# Altium schematic sheet UART_2_MUX.SchDoc
size 250 x 160 mm; SheetNumber: 15; SheetTotal: 15
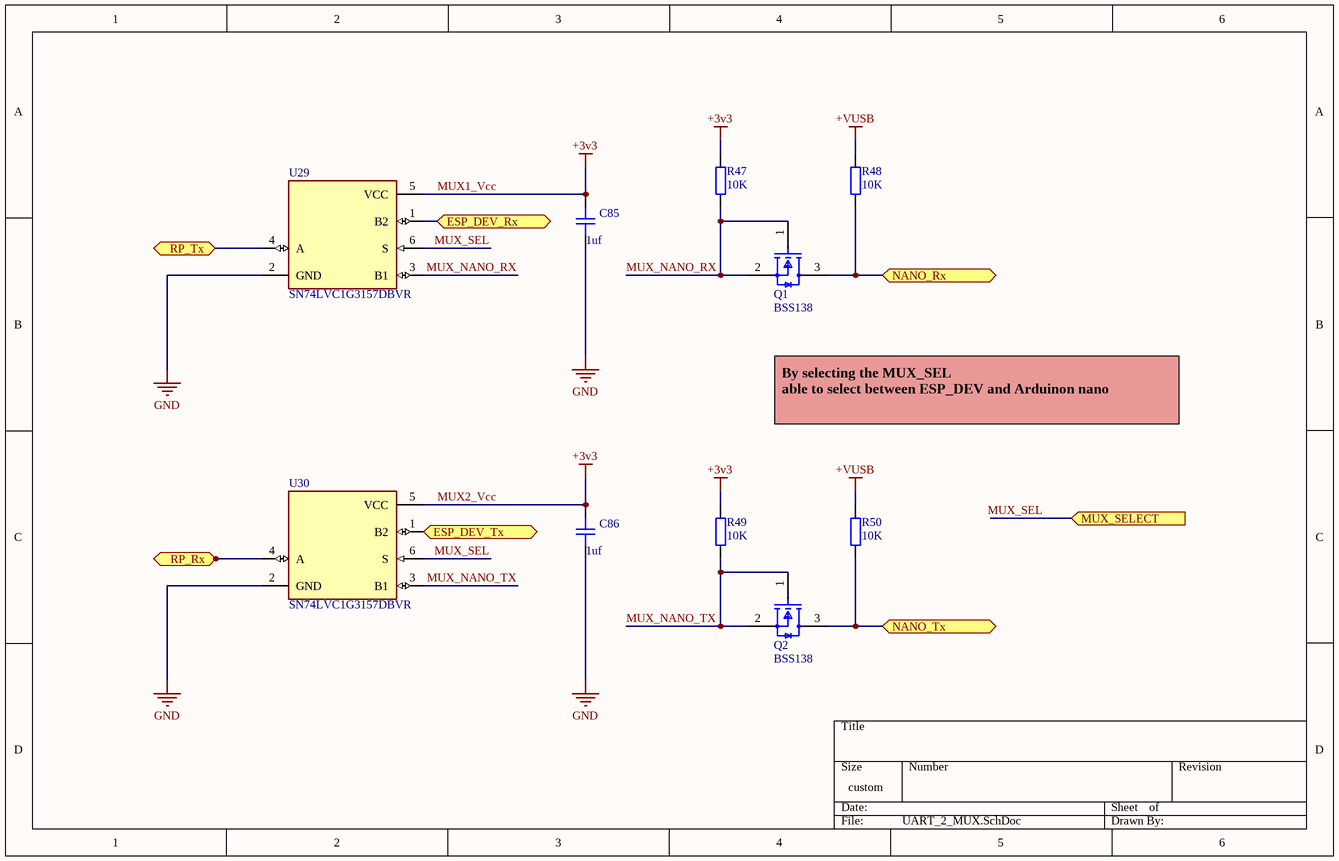
[diagram p0: UART_2_MUX.SchDoc]

## Parts
C85  1uf  [CAP_0603]
C86  1uf  [CAP_0603]
Q1  BSS138  [FP-318-08-IPC_B]
Q2  BSS138  [FP-318-08-IPC_B]
R47  10K  [RES_0603]
R48  10K  [RES_0603]
R49  10K  [RES_0603]
R50  10K  [RES_0603]
U29  SN74LVC1G3157DBVR  [FP-DBV0006A-IPC_C]
U30  SN74LVC1G3157DBVR  [FP-DBV0006A-IPC_C]

## Ports
ESP_DEV_Rx (bidir), ESP_DEV_Tx (bidir), MUX_SELECT (in), NANO_Rx (bidir), NANO_Tx (bidir), RP_Rx (bidir), RP_Tx (bidir)

## Nets
+VUSB: R48.1 R50.1
GND: C85.1 C86.1 U29.2(GND) U30.2(GND)
MUX1_Vcc: C85.2 C86.2 R47.1 R49.1 U29.5(VCC) U30.5(VCC)  [also labelled +3v3, MUX2_Vcc]
ESP_DEV_Rx: U29.1(B2) ; port ESP_DEV_Rx
ESP_DEV_Tx: U30.1(B2) ; port ESP_DEV_Tx
MUX_NANO_RX: Q1.1(G) Q1.2(S) R47.2 U29.3(B1)
MUX_NANO_TX: Q2.1(G) Q2.2(S) R49.2 U30.3(B1)
MUX_SEL: U29.6(S) U30.6(S) ; port MUX_SELECT
NANO_Rx: Q1.3(D) R48.2 ; port NANO_Rx
NANO_Tx: Q2.3(D) R50.2 ; port NANO_Tx
RP_Rx: U30.4(A) ; port RP_Rx
RP_Tx: U29.4(A) ; port RP_Tx

## Notes on the sheet
- By selecting the MUX_SEL
  able to select between ESP_DEV and Arduinon nano

## Library data of the parts
C85 C86 = CAP_0603: Capacitor SMD 0603; Manufacturer: *; Manufacturer Part Number: *; Distributor Link: *; LCSC: *; Rating: *; Dielectric: *
Q1 Q2 = CMP-07173-000101-1: MOSFET N-CH 50V 220MA SOT-23; Turn-Off Delay Time: 20ns; Element Configuration: Single; Rds On Max: 3.5R; Gate to Source Voltage (Vgs): 20V; Threshold Voltage: 1.3V; Number of Elements: 1; Power Dissipation: 360mW; Rise Time: 9ns; Turn-On Delay Time: 2.5ns; Input Capacitance: 27pF; On-State Resistance: 6R; Lead Free: Lead Free; Length: 2.92mm; Width: 1.3mm; Drain to Source Breakdown Voltage: 50V; Min Operating Temperature: -55°C; REACH SVHC: No SVHC; Packaging: Tape and Reel; Radiation Hardening: No; Height: 0.93mm; Drain to Source Voltage (Vdss): 50V; Current Rating: 220mA; Voltage Rating (DC): 50V; Weight: 0.03g; Continuous Drain Current (ID): 220mA; Number of Pins: 3; Nominal Vgs: 1.3V; Max Power Dissipation: 360mW; Fall Time: 9ns; Drain to Source Resistance: 3.5R; Contact Plating: Tin; Case/Package: SOT-23; Package Quantity: 1; Dual Supply Voltage: 50V; Mount: Surface Mount; Termination: SMD/SMT; Max Operating Temperature: 150°C
R47-R50 = RES_0603: Resistor SMD 0603; Manufacturer: *; Manufacturer Part Number: *; Distributor Link: *; LCSC: *
U29 U30 = CMP-0859-00203-4: IC SWITCH SPDT SOT23-6; Number of Outputs: 2; Propagation Delay: 300ps; On-State Resistance: 15R; Nominal Supply Current: 10uA; Number of Inputs: 1; Max Supply Voltage: 5.5V; Supply Type: Single; Low Level Output Current: 128mA; Bandwidth: 300MHz; Turn-Off Delay Time: 3.8ns; Turn-On Delay Time: 5.7ns; Operating Supply Current: 1uA; Min Supply Voltage: 1.65V; Polarity: Non-Inverting; Height: 1.3mm; Number of Bits: 1; Case/Package: SOT-23; REACH SVHC: No SVHC; High Level Output Current: 128mA; Weight: 0.000229oz; Max Supply Current: 10uA; Width: 1.75mm; Radiation Hardening: No; Supply Current: 10uA; Length: 3.05mm; Max Operating Temperature: 125°C; Min Operating Temperature: -40°C; Package Quantity: 3000; Number of Pins: 6; Termination: SMD/SMT; Series: 74LVC; Packaging: Tape and Reel; Lead Free: Lead Free; Contact Plating: Gold; Mount: Surface Mount; RoHS Compliant: Yes; Number of Channels: 1; Throw Configuration: SPDT